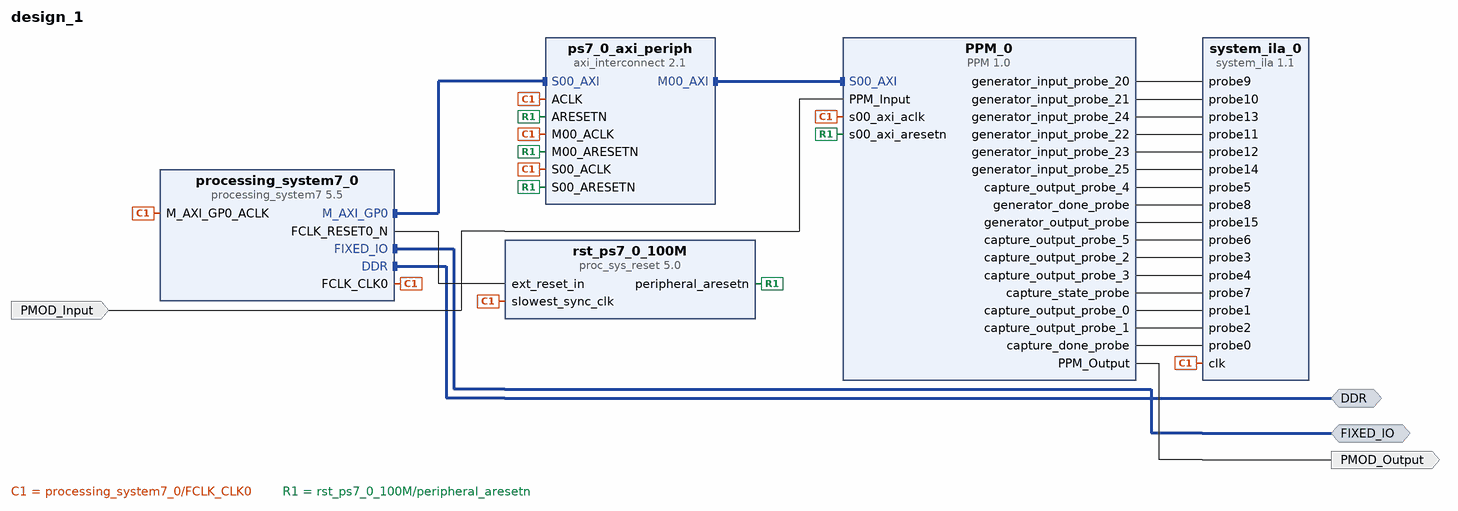
[diagram p0: block diagram of the top level]
# Vivado block design design_1, xc7z020clg484-1, Vivado 2020.1
create_bd_design design_1

create_bd_intf_port -mode Master -vlnv xilinx.com:interface:ddrx_rtl:1.0 DDR
create_bd_intf_port -mode Master -vlnv xilinx.com:display_processing_system7:fixedio_rtl:1.0 FIXED_IO
create_bd_port -dir I PMOD_Input
create_bd_port -dir O PMOD_Output

create_bd_cell -type ip -vlnv xilinx.com:ip:processing_system7:5.5 processing_system7_0
set_property -dict [list \
  CONFIG.PCW_APU_PERIPHERAL_FREQMHZ 666.666667 \
  CONFIG.PCW_ENET0_ENET0_IO {MIO 16 .. 27} \
  CONFIG.PCW_ENET0_GRP_MDIO_ENABLE 1 \
  CONFIG.PCW_ENET0_GRP_MDIO_IO {MIO 52 .. 53} \
  CONFIG.PCW_ENET0_PERIPHERAL_ENABLE 1 \
  CONFIG.PCW_ENET0_RESET_ENABLE 0 \
  CONFIG.PCW_ENET_RESET_ENABLE 1 \
  CONFIG.PCW_ENET_RESET_SELECT {Share reset pin} \
  CONFIG.PCW_FPGA0_PERIPHERAL_FREQMHZ 100.000000 \
  CONFIG.PCW_FPGA1_PERIPHERAL_FREQMHZ 150.000000 \
  CONFIG.PCW_GPIO_MIO_GPIO_ENABLE 1 \
  CONFIG.PCW_GPIO_MIO_GPIO_IO MIO \
  CONFIG.PCW_I2C_RESET_ENABLE 1 \
  CONFIG.PCW_PRESET_BANK1_VOLTAGE {LVCMOS 1.8V} \
  CONFIG.PCW_QSPI_GRP_SINGLE_SS_ENABLE 1 \
  CONFIG.PCW_QSPI_GRP_SINGLE_SS_IO {MIO 1 .. 6} \
  CONFIG.PCW_QSPI_PERIPHERAL_ENABLE 1 \
  CONFIG.PCW_QSPI_QSPI_IO {MIO 1 .. 6} \
  CONFIG.PCW_SD0_GRP_CD_ENABLE 1 \
  CONFIG.PCW_SD0_GRP_CD_IO {MIO 47} \
  CONFIG.PCW_SD0_GRP_WP_ENABLE 1 \
  CONFIG.PCW_SD0_GRP_WP_IO {MIO 46} \
  CONFIG.PCW_SD0_PERIPHERAL_ENABLE 1 \
  CONFIG.PCW_SD0_SD0_IO {MIO 40 .. 45} \
  CONFIG.PCW_SDIO_PERIPHERAL_FREQMHZ 50 \
  CONFIG.PCW_SINGLE_QSPI_DATA_MODE x4 \
  CONFIG.PCW_TTC0_PERIPHERAL_ENABLE 1 \
  CONFIG.PCW_TTC0_TTC0_IO EMIO \
  CONFIG.PCW_UART1_PERIPHERAL_ENABLE 1 \
  CONFIG.PCW_UART1_UART1_IO {MIO 48 .. 49} \
  CONFIG.PCW_UART_PERIPHERAL_FREQMHZ 50 \
  CONFIG.PCW_UIPARAM_DDR_FREQ_MHZ 533.333313 \
  CONFIG.PCW_UIPARAM_DDR_PARTNO {MT41J128M16 HA-15E} \
  CONFIG.PCW_USB0_PERIPHERAL_ENABLE 1 \
  CONFIG.PCW_USB0_RESET_ENABLE 0 \
  CONFIG.PCW_USB0_USB0_IO {MIO 28 .. 39} \
  CONFIG.PCW_USB_RESET_ENABLE 1 \
  CONFIG.PCW_USB_RESET_SELECT {Share reset pin} \
  CONFIG.preset ZedBoard \
] [get_bd_cells processing_system7_0]
# 223 more settings of processing_system7_0 are not shown: defaults, MIO pin electricals, DDR timing, and values the tool derives
create_bd_cell -type ip -vlnv xilinx.com:ip:axi_interconnect:2.1 ps7_0_axi_periph
set_property -dict {CONFIG.NUM_MI 1} [get_bd_cells ps7_0_axi_periph]
create_bd_cell -type ip -vlnv xilinx.com:ip:proc_sys_reset:5.0 rst_ps7_0_100M
create_bd_cell -type ip -vlnv xilinx.com:ip:system_ila:1.1 system_ila_0
set_property -dict [list \
  CONFIG.C_DATA_DEPTH 4096 \
  CONFIG.C_MON_TYPE NATIVE \
  CONFIG.C_NUM_OF_PROBES 16 \
  CONFIG.C_PROBE0_TYPE 0 \
  CONFIG.C_PROBE10_TYPE 0 \
  CONFIG.C_PROBE11_TYPE 0 \
  CONFIG.C_PROBE12_TYPE 0 \
  CONFIG.C_PROBE13_TYPE 0 \
  CONFIG.C_PROBE14_TYPE 0 \
  CONFIG.C_PROBE15_TYPE 0 \
  CONFIG.C_PROBE1_TYPE 0 \
  CONFIG.C_PROBE2_TYPE 0 \
  CONFIG.C_PROBE3_TYPE 0 \
  CONFIG.C_PROBE4_TYPE 0 \
  CONFIG.C_PROBE5_TYPE 0 \
  CONFIG.C_PROBE6_TYPE 0 \
  CONFIG.C_PROBE7_TYPE 0 \
  CONFIG.C_PROBE8_TYPE 0 \
  CONFIG.C_PROBE9_TYPE 0 \
] [get_bd_cells system_ila_0]
create_bd_cell -type ip -vlnv xilinx.com:user:PPM:1.0 PPM_0

# ---- connections ----

connect_bd_intf_net [get_bd_intf_pins processing_system7_0/M_AXI_GP0] [get_bd_intf_pins ps7_0_axi_periph/S00_AXI]
connect_bd_intf_net [get_bd_intf_ports FIXED_IO] [get_bd_intf_pins processing_system7_0/FIXED_IO]
connect_bd_intf_net [get_bd_intf_ports DDR] [get_bd_intf_pins processing_system7_0/DDR]
connect_bd_intf_net [get_bd_intf_pins ps7_0_axi_periph/M00_AXI] [get_bd_intf_pins PPM_0/S00_AXI]
connect_bd_net [get_bd_pins processing_system7_0/FCLK_CLK0] \
  [get_bd_pins processing_system7_0/M_AXI_GP0_ACLK] [get_bd_pins ps7_0_axi_periph/S00_ACLK] \
  [get_bd_pins rst_ps7_0_100M/slowest_sync_clk] [get_bd_pins ps7_0_axi_periph/M00_ACLK] [get_bd_pins ps7_0_axi_periph/ACLK] \
  [get_bd_pins system_ila_0/clk] [get_bd_pins PPM_0/s00_axi_aclk]
connect_bd_net [get_bd_pins processing_system7_0/FCLK_RESET0_N] [get_bd_pins rst_ps7_0_100M/ext_reset_in]
connect_bd_net [get_bd_pins rst_ps7_0_100M/peripheral_aresetn] \
  [get_bd_pins ps7_0_axi_periph/S00_ARESETN] [get_bd_pins ps7_0_axi_periph/M00_ARESETN] \
  [get_bd_pins ps7_0_axi_periph/ARESETN] [get_bd_pins PPM_0/s00_axi_aresetn]
connect_bd_net [get_bd_ports PMOD_Input] [get_bd_pins PPM_0/PPM_Input]
connect_bd_net [get_bd_pins PPM_0/PPM_Output] [get_bd_ports PMOD_Output]
connect_bd_net -net generator_input_probe_20 [get_bd_pins PPM_0/generator_input_probe_20] [get_bd_pins system_ila_0/probe9]
connect_bd_net -net generator_input_probe_21 [get_bd_pins PPM_0/generator_input_probe_21] [get_bd_pins system_ila_0/probe10]
connect_bd_net -net generator_input_probe_24 [get_bd_pins PPM_0/generator_input_probe_24] [get_bd_pins system_ila_0/probe13]
connect_bd_net -net generator_input_probe_22 [get_bd_pins PPM_0/generator_input_probe_22] [get_bd_pins system_ila_0/probe11]
connect_bd_net -net generator_input_probe_23 [get_bd_pins PPM_0/generator_input_probe_23] [get_bd_pins system_ila_0/probe12]
connect_bd_net -net generator_input_probe_25 [get_bd_pins PPM_0/generator_input_probe_25] [get_bd_pins system_ila_0/probe14]
connect_bd_net -net capture_output_probe_4 [get_bd_pins PPM_0/capture_output_probe_4] [get_bd_pins system_ila_0/probe5]
connect_bd_net -net generator_done_probe [get_bd_pins PPM_0/generator_done_probe] [get_bd_pins system_ila_0/probe8]
connect_bd_net -net generator_output_probe [get_bd_pins PPM_0/generator_output_probe] [get_bd_pins system_ila_0/probe15]
connect_bd_net -net capture_output_probe_5 [get_bd_pins PPM_0/capture_output_probe_5] [get_bd_pins system_ila_0/probe6]
connect_bd_net -net capture_output_probe_2 [get_bd_pins PPM_0/capture_output_probe_2] [get_bd_pins system_ila_0/probe3]
connect_bd_net -net capture_output_probe_3 [get_bd_pins PPM_0/capture_output_probe_3] [get_bd_pins system_ila_0/probe4]
connect_bd_net -net capture_state_probe [get_bd_pins PPM_0/capture_state_probe] [get_bd_pins system_ila_0/probe7]
connect_bd_net -net capture_output_probe_0 [get_bd_pins PPM_0/capture_output_probe_0] [get_bd_pins system_ila_0/probe1]
connect_bd_net -net capture_output_probe_1 [get_bd_pins PPM_0/capture_output_probe_1] [get_bd_pins system_ila_0/probe2]
connect_bd_net -net capture_done_probe [get_bd_pins PPM_0/capture_done_probe] [get_bd_pins system_ila_0/probe0]
set_property HDL_ATTRIBUTE.DEBUG true [get_bd_nets generator_input_probe_20]
set_property HDL_ATTRIBUTE.MARK_DEBUG true [get_bd_nets generator_input_probe_20]
set_property HDL_ATTRIBUTE.DEBUG true [get_bd_nets generator_input_probe_21]
set_property HDL_ATTRIBUTE.MARK_DEBUG true [get_bd_nets generator_input_probe_21]
set_property HDL_ATTRIBUTE.DEBUG true [get_bd_nets generator_input_probe_24]
set_property HDL_ATTRIBUTE.MARK_DEBUG true [get_bd_nets generator_input_probe_24]
set_property HDL_ATTRIBUTE.DEBUG true [get_bd_nets generator_input_probe_22]
set_property HDL_ATTRIBUTE.MARK_DEBUG true [get_bd_nets generator_input_probe_22]
set_property HDL_ATTRIBUTE.DEBUG true [get_bd_nets generator_input_probe_23]
set_property HDL_ATTRIBUTE.MARK_DEBUG true [get_bd_nets generator_input_probe_23]
set_property HDL_ATTRIBUTE.DEBUG true [get_bd_nets generator_input_probe_25]
set_property HDL_ATTRIBUTE.MARK_DEBUG true [get_bd_nets generator_input_probe_25]
set_property HDL_ATTRIBUTE.DEBUG true [get_bd_nets capture_output_probe_4]
set_property HDL_ATTRIBUTE.MARK_DEBUG true [get_bd_nets capture_output_probe_4]
set_property HDL_ATTRIBUTE.DEBUG true [get_bd_nets generator_done_probe]
set_property HDL_ATTRIBUTE.MARK_DEBUG true [get_bd_nets generator_done_probe]
set_property HDL_ATTRIBUTE.DEBUG true [get_bd_nets generator_output_probe]
set_property HDL_ATTRIBUTE.MARK_DEBUG true [get_bd_nets generator_output_probe]
set_property HDL_ATTRIBUTE.DEBUG true [get_bd_nets capture_output_probe_5]
set_property HDL_ATTRIBUTE.MARK_DEBUG true [get_bd_nets capture_output_probe_5]
set_property HDL_ATTRIBUTE.DEBUG true [get_bd_nets capture_output_probe_2]
set_property HDL_ATTRIBUTE.MARK_DEBUG true [get_bd_nets capture_output_probe_2]
set_property HDL_ATTRIBUTE.DEBUG true [get_bd_nets capture_output_probe_3]
set_property HDL_ATTRIBUTE.MARK_DEBUG true [get_bd_nets capture_output_probe_3]
set_property HDL_ATTRIBUTE.DEBUG true [get_bd_nets capture_state_probe]
set_property HDL_ATTRIBUTE.MARK_DEBUG true [get_bd_nets capture_state_probe]
set_property HDL_ATTRIBUTE.DEBUG true [get_bd_nets capture_output_probe_0]
set_property HDL_ATTRIBUTE.MARK_DEBUG true [get_bd_nets capture_output_probe_0]
set_property HDL_ATTRIBUTE.DEBUG true [get_bd_nets capture_output_probe_1]
set_property HDL_ATTRIBUTE.MARK_DEBUG true [get_bd_nets capture_output_probe_1]
set_property HDL_ATTRIBUTE.DEBUG true [get_bd_nets capture_done_probe]
set_property HDL_ATTRIBUTE.MARK_DEBUG true [get_bd_nets capture_done_probe]

# ---- address map ----
assign_bd_address -offset 0x43C00000 -range 64K -target_address_space [get_bd_addr_spaces processing_system7_0/Data] [get_bd_addr_segs PPM_0/S00_AXI/S00_AXI_reg]

validate_bd_design
save_bd_design
